# Altium project DC309A.PrjPcb (part 7 of 7)
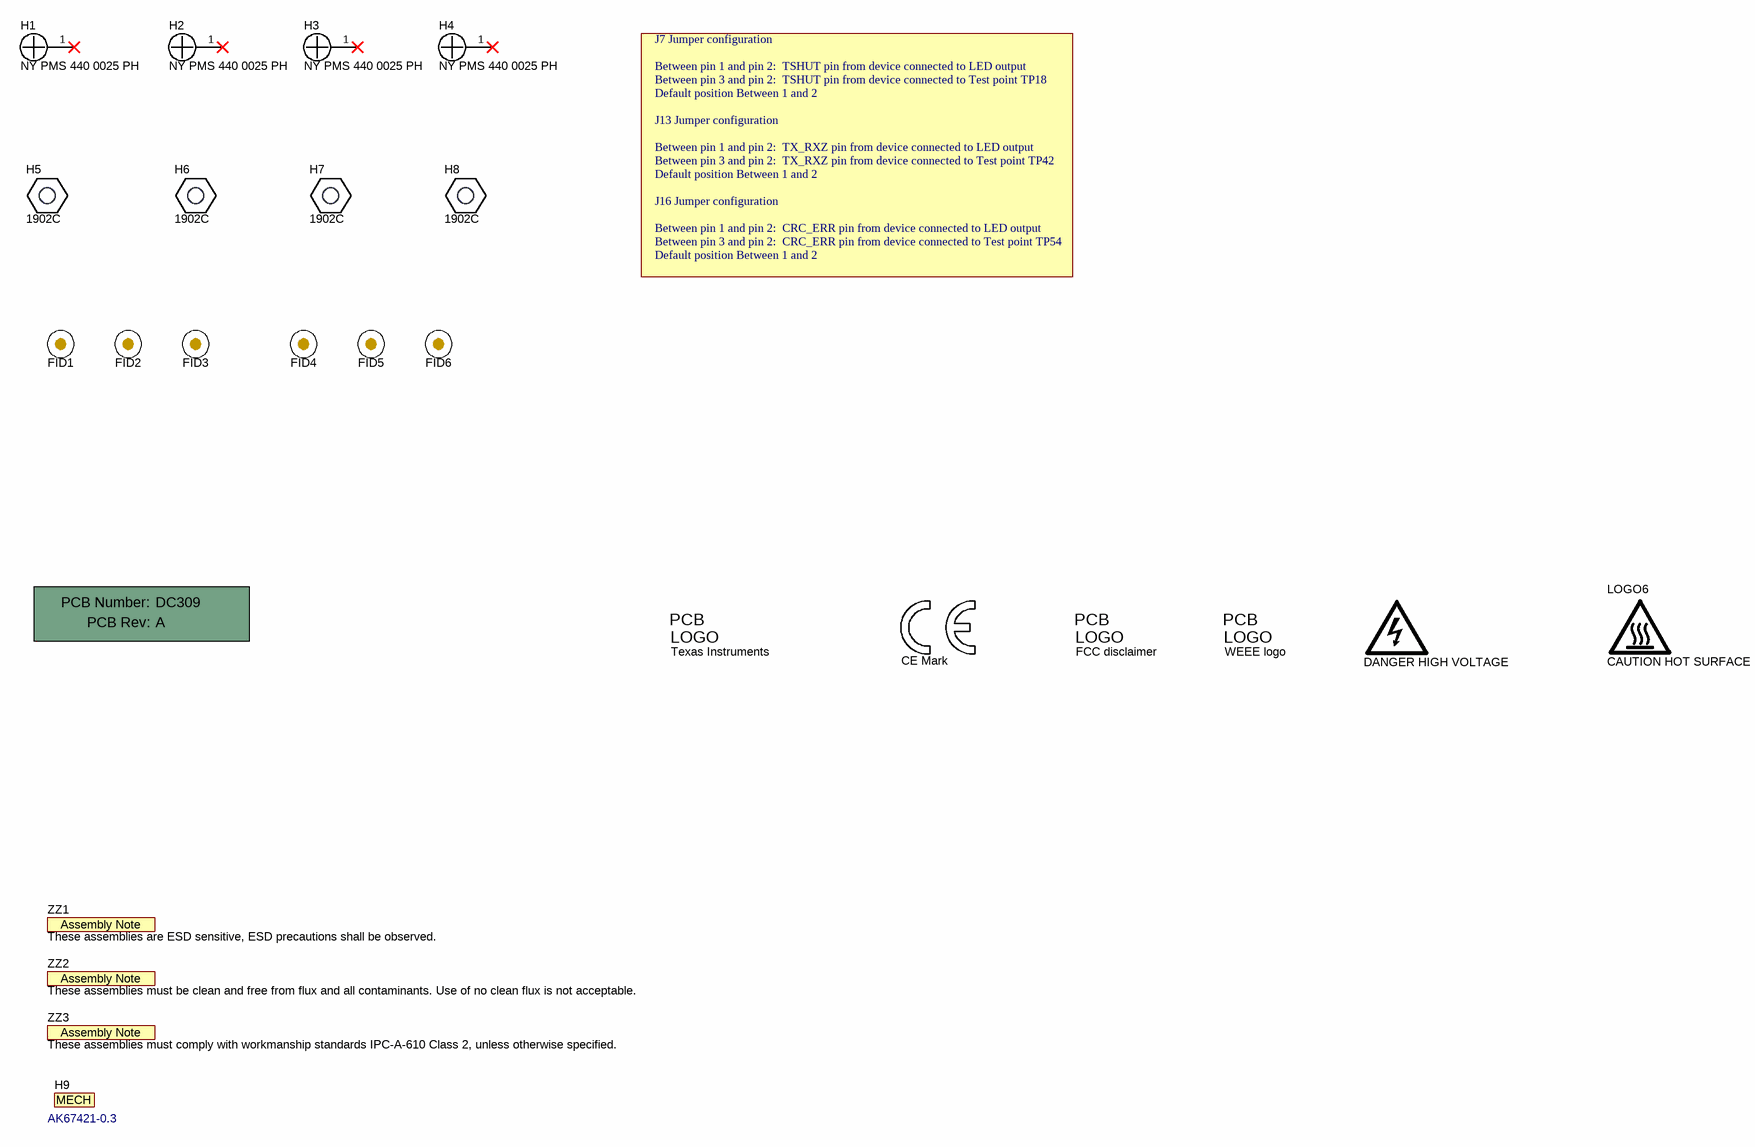
[diagram p31: DC309A_EVM_Hardware.SchDoc]

## Nets that join several sheets
3P3V_FTDI: DC309A_FTDI (43 pins), DC309A_FTDI(DNI) (7 pins)
AVDD_IO: DC309A_Pinout (8 pins), DC309A_PowerSupplies (R17.2)
GND: DC309A_Pinout (52 pins), DC309A_RXIN (164 pins), DC309A_TXOUT (137 pins), DC309A_PowerSupplies (46 pins), DC309A_FTDI (19 pins), DC309A_CLKGen (44 pins), DC309A_External_Sync (26 pins), DC309A_CPLD (53 pins), DC309A_FTDI(DNI) (8 pins)
MHV: DC309A_Pinout (24 pins), DC309A_PowerSupplies (5 pins)
PHV: DC309A_Pinout (16 pins), DC309A_PowerSupplies (5 pins)
USB_GND: DC309A_FTDI (54 pins), DC309A_FTDI(DNI) (8 pins)
V_1P8: DC309A_PowerSupplies (9 pins), DC309A_CPLD (J11.4)
V_2P5: DC309A_PowerSupplies (7 pins), DC309A_FTDI (U6.10 U8.10 U14.10 U17.10), DC309A_FTDI(DNI) (U6_1.10 U8_1.10 U14_1.10 U17_1.10)
V_3P3: DC309A_PowerSupplies (5 pins), DC309A_FTDI (C161.1 R152.2 R154.2 U16.8), DC309A_External_Sync (18 pins)
VDDM_LV5: DC309A_Pinout (6 pins), DC309A_PowerSupplies (5 pins)
VDDP_LV5: DC309A_Pinout (6 pins), DC309A_PowerSupplies (17 pins)
CLK_SYNC_LATCH: DC309A_CLKGen (R244.2), DC309A_External_Sync (U42.1 U42.5)
CLKM_CPLD: DC309A_CLKGen (U12.21), DC309A_CPLD (U11.3)
CLKP_CPLD: DC309A_CLKGen (U12.22), DC309A_CPLD (U11.4)
CRC_ERR_FUNC: DC309A_Pinout (J16.1 R45.1), DC309A_CPLD (U9.38)
EN_CRC: DC309A_Pinout (R420.1 R424.2 U1.B10), DC309A_CPLD (TP26.1 U9.33)
ENSYNC_FTDI: DC309A_FTDI (U6.3 U7.20), DC309A_FTDI(DNI) (U6_1.3)
ENSYNC_TO_CPLD: DC309A_FTDI (U6.14), DC309A_External_Sync (U40.3), DC309A_CPLD (U9.96), DC309A_FTDI(DNI) (U6_1.14)
EXTERNAL_SYNC: DC309A_External_Sync (J12.1 R139.2 R276.2), DC309A_CPLD (U9.84)
OUT1: DC309A_Pinout (U1.A9), DC309A_TXOUT (R352.1)
OUT2: DC309A_Pinout (U1.A8), DC309A_TXOUT (R347.1)
OUT3: DC309A_Pinout (U1.B8), DC309A_TXOUT (R362.1 TP53.1)
OUT4: DC309A_Pinout (U1.B9), DC309A_TXOUT (R387.1 TP55.1)
OUT5: DC309A_Pinout (U1.E7), DC309A_TXOUT (R365.1)
OUT6: DC309A_Pinout (U1.D7), DC309A_TXOUT (R389.1)
OUT7: DC309A_Pinout (U1.E5), DC309A_TXOUT (R369.1)
OUT8: DC309A_Pinout (U1.D6), DC309A_TXOUT (R391.1)
OUT9: DC309A_Pinout (U1.D5), DC309A_TXOUT (R371.1 TP85.1)
OUT10: DC309A_Pinout (U1.C5), DC309A_TXOUT (R393.1 TP86.1)
OUT11: DC309A_Pinout (U1.C8), DC309A_TXOUT (R373.1)
OUT12: DC309A_Pinout (U1.C7), DC309A_TXOUT (R395.1)
OUT13: DC309A_Pinout (U1.B5), DC309A_TXOUT (R397.1)
OUT14: DC309A_Pinout (U1.B6), DC309A_TXOUT (R432.1)
OUT15: DC309A_Pinout (U1.B7), DC309A_TXOUT (R399.1 TP56.1)
OUT16: DC309A_Pinout (U1.C6), DC309A_TXOUT (R434.1 TP60.1)
OUT17: DC309A_Pinout (U1.A3), DC309A_TXOUT (R404.1)
OUT18: DC309A_Pinout (U1.A2), DC309A_TXOUT (R436.1)
OUT19: DC309A_Pinout (U1.A1), DC309A_TXOUT (R406.1 TP57.1)
OUT20: DC309A_Pinout (U1.B2), DC309A_TXOUT (R438.1 TP61.1)
OUT21: DC309A_Pinout (U1.G3), DC309A_TXOUT (R408.1 TP58.1)
OUT22: DC309A_Pinout (U1.G2), DC309A_TXOUT (R440.1 TP62.1)
OUT23: DC309A_Pinout (U1.G1), DC309A_TXOUT (R410.1 TP87.1)
OUT24: DC309A_Pinout (U1.F2), DC309A_TXOUT (R442.1 TP88.1)
OUT25: DC309A_Pinout (U1.B3), DC309A_TXOUT (R444.1 TP89.1)
OUT26: DC309A_Pinout (U1.B4), DC309A_TXOUT (R468.1 TP91.1)
OUT27: DC309A_Pinout (U1.F3), DC309A_TXOUT (R446.1)
OUT28: DC309A_Pinout (U1.E3), DC309A_TXOUT (R470.1)
OUT29: DC309A_Pinout (U1.F1), DC309A_TXOUT (R448.1 TP90.1)
OUT30: DC309A_Pinout (U1.E2), DC309A_TXOUT (R472.1 TP92.1)
OUT31: DC309A_Pinout (U1.E1), DC309A_TXOUT (R450.1)
OUT32: DC309A_Pinout (U1.B1), DC309A_TXOUT (R474.1)
OUT33: DC309A_Pinout (U1.P9), DC309A_TXOUT (R452.1 TP63.1)
OUT34: DC309A_Pinout (U1.P8), DC309A_TXOUT (R476.1 TP64.1)
OUT35: DC309A_Pinout (U1.N8), DC309A_TXOUT (R454.1 TP48.1)
OUT36: DC309A_Pinout (U1.N9), DC309A_TXOUT (R478.1 TP49.1)
OUT37: DC309A_Pinout (U1.K7), DC309A_TXOUT (R480.1)
OUT38: DC309A_Pinout (U1.L7), DC309A_TXOUT (R504.1)
OUT39: DC309A_Pinout (U1.K5), DC309A_TXOUT (R482.1)
OUT40: DC309A_Pinout (U1.L6), DC309A_TXOUT (R506.1)
OUT41: DC309A_Pinout (U1.L5), DC309A_TXOUT (R484.1)
OUT42: DC309A_Pinout (U1.M5), DC309A_TXOUT (R508.1)
OUT43: DC309A_Pinout (U1.M8), DC309A_TXOUT (R486.1 TP93.1)
OUT44: DC309A_Pinout (U1.M7), DC309A_TXOUT (R510.1 TP94.1)
OUT45: DC309A_Pinout (U1.N5), DC309A_TXOUT (R488.1)
OUT46: DC309A_Pinout (U1.N6), DC309A_TXOUT (R512.1)
OUT47: DC309A_Pinout (U1.N7), DC309A_TXOUT (R490.1)
OUT48: DC309A_Pinout (U1.M6), DC309A_TXOUT (R514.1)
OUT49: DC309A_Pinout (U1.P3), DC309A_TXOUT (R516.1 TP95.1)
OUT50: DC309A_Pinout (U1.P2), DC309A_TXOUT (R540.1 TP98.1)
OUT51: DC309A_Pinout (U1.P1), DC309A_TXOUT (R518.1)
OUT52: DC309A_Pinout (U1.N2), DC309A_TXOUT (R542.1)
OUT53: DC309A_Pinout (U1.H3), DC309A_TXOUT (R520.1 TP96.1)
OUT54: DC309A_Pinout (U1.H2), DC309A_TXOUT (R544.1 TP99.1)
OUT55: DC309A_Pinout (U1.H1), DC309A_TXOUT (R522.1 TP65.1)
OUT56: DC309A_Pinout (U1.J2), DC309A_TXOUT (R546.1 TP66.1)
OUT57: DC309A_Pinout (U1.N3), DC309A_TXOUT (R524.1 TP97.1)
OUT58: DC309A_Pinout (U1.N4), DC309A_TXOUT (R548.1 TP100.1)
OUT59: DC309A_Pinout (U1.J3), DC309A_TXOUT (R526.1)
OUT60: DC309A_Pinout (U1.K3), DC309A_TXOUT (R550.1)
OUT61: DC309A_Pinout (U1.J1), DC309A_TXOUT (R552.1)
OUT62: DC309A_Pinout (U1.K2), DC309A_TXOUT (R560.1)
OUT63: DC309A_Pinout (U1.K1), DC309A_TXOUT (R554.1 TP67.1)
OUT64: DC309A_Pinout (U1.N1), DC309A_TXOUT (R562.1 TP68.1)
RESET_0: DC309A_FTDI (TP15.1 U8.14), DC309A_CPLD (R22.1), DC309A_FTDI(DNI) (U8_1.14)
RESET_DIV_FTDI: DC309A_FTDI (U7.49 U14.3), DC309A_FTDI(DNI) (U14_1.3)
RESET_DIV_TO_CPLD: DC309A_FTDI (U14.14), DC309A_CPLD (R138.1 U9.97), DC309A_FTDI(DNI) (U14_1.14)
RESET_FTDI: DC309A_FTDI (U7.15 U8.3), DC309A_FTDI(DNI) (U8_1.3)
RST: DC309A_Pinout (U1.E8), DC309A_CPLD (R125.2 R128.2)
RXP1: DC309A_Pinout (U1.B14), DC309A_RXIN (C179.1 J6.12 R94.2)
RXP2: DC309A_Pinout (U1.A14), DC309A_RXIN (C195.1 J6.10 R239.2)
RXP3: DC309A_Pinout (U1.B13), DC309A_RXIN (C188.1 J6.16 R107.2)
RXP4: DC309A_Pinout (U1.A13), DC309A_RXIN (C204.1 J6.18 R282.2)
RXP5: DC309A_Pinout (U1.A12), DC309A_RXIN (C79.1 J5.10 R55.2)
RXP6: DC309A_Pinout (U1.B12), DC309A_RXIN (C95.1 J5.12 R81.2)
RXP7: DC309A_Pinout (U1.E12), DC309A_RXIN (C189.1 J6.22 R117.2)
RXP8: DC309A_Pinout (U1.F12), DC309A_RXIN (C205.1 J6.24 R287.2)
RXP9: DC309A_Pinout (U1.D12), DC309A_RXIN (C186.1 J6.17 R102.2 TP69.1)
RXP10: DC309A_Pinout (U1.C12), DC309A_RXIN (C202.1 J6.15 R261.2 TP70.1)
RXP11: DC309A_Pinout (U1.A11), DC309A_RXIN (C71.1 J5.4 R46.2)
RXP12: DC309A_Pinout (U1.B11), DC309A_RXIN (C87.1 J5.6 R64.2)
RXP13: DC309A_Pinout (U1.C13), DC309A_RXIN (C181.1 J5.22 R96.2)
RXP14: DC309A_Pinout (U1.D13), DC309A_RXIN (C197.1 J5.24 R256.2)
RXP15: DC309A_Pinout (U1.D14), DC309A_RXIN (C74.1 J5.23 R49.2 TP101.1)
RXP16: DC309A_Pinout (U1.C14), DC309A_RXIN (C90.1 J5.21 R70.2 TP105.1)
RXP17: DC309A_Pinout (U1.F11), DC309A_RXIN (C78.1 J6.21 R54.2 TP71.1)
RXP18: DC309A_Pinout (U1.F10), DC309A_RXIN (C94.1 J6.23 R80.2 TP72.1)
RXP19: DC309A_Pinout (U1.F8), DC309A_RXIN (C72.1 J5.5 R47.2 TP102.1)
RXP20: DC309A_Pinout (U1.F9), DC309A_RXIN (C88.1 J5.3 R68.2 TP106.1)
RXP21: DC309A_Pinout (U1.C11), DC309A_RXIN (C187.1 J5.11 R106.2 TP103.1)
RXP22: DC309A_Pinout (U1.D11), DC309A_RXIN (C203.1 J5.9 R281.2 TP107.1)
RXP23: DC309A_Pinout (U1.D10), DC309A_RXIN (C180.1 J5.15 R95.2 TP104.1)
RXP24: DC309A_Pinout (U1.C10), DC309A_RXIN (C196.1 J5.17 R255.2 TP108.1)
RXP25: DC309A_Pinout (U1.D9), DC309A_RXIN (C80.1 J6.6 R56.2)
RXP26: DC309A_Pinout (U1.E9), DC309A_RXIN (C96.1 J6.4 R82.2)
RXP27: DC309A_Pinout (U1.G11), DC309A_RXIN (C178.1 J5.18 R93.2)
RXP28: DC309A_Pinout (U1.G12), DC309A_RXIN (C194.1 J5.16 R238.2)
RXP29: DC309A_Pinout (U1.G8), DC309A_RXIN (C81.1 J6.11 R57.2 TP73.1)
RXP30: DC309A_Pinout (U1.G9), DC309A_RXIN (C97.1 J6.9 R83.2 TP75.1)
RXP31: DC309A_Pinout (U1.G6), DC309A_RXIN (C84.1 J6.5 R60.2 TP74.1)
RXP32: DC309A_Pinout (U1.G7), DC309A_RXIN (C175.1 J6.3 R87.2 TP76.1)
RXP33: DC309A_Pinout (U1.N14), DC309A_RXIN (C191.1 J5.34 R159.2)
RXP34: DC309A_Pinout (U1.P14), DC309A_RXIN (C213.1 J5.36 R289.2)
RXP35: DC309A_Pinout (U1.N13), DC309A_RXIN (C86.1 J6.34 R63.2)
RXP36: DC309A_Pinout (U1.P13), DC309A_RXIN (C177.1 J6.36 R90.2)
RXP37: DC309A_Pinout (U1.P12), DC309A_RXIN (C82.1 J5.45 R58.2 TP109.1)
RXP38: DC309A_Pinout (U1.N12), DC309A_RXIN (C98.1 J5.47 R84.2 TP112.1)
RXP39: DC309A_Pinout (U1.K12), DC309A_RXIN (C190.1 J5.29 R121.2 TP110.1)
RXP40: DC309A_Pinout (U1.J12), DC309A_RXIN (C207.1 J5.27 R288.2 TP113.1)
RXP41: DC309A_Pinout (U1.L12), DC309A_RXIN (C193.1 J5.39 R237.2 TP111.1)
RXP42: DC309A_Pinout (U1.M12), DC309A_RXIN (C215.1 J5.41 R291.2 TP114.1)
RXP43: DC309A_Pinout (U1.P11), DC309A_RXIN (C76.1 J6.45 R51.2 TP77.1)
RXP44: DC309A_Pinout (U1.N11), DC309A_RXIN (C92.1 J6.47 R75.2 TP81.1)
RXP45: DC309A_Pinout (U1.M13), DC309A_RXIN (C75.1 J6.29 R50.2 TP78.1)
RXP46: DC309A_Pinout (U1.L13), DC309A_RXIN (C91.1 J6.27 R71.2 TP82.1)
RXP47: DC309A_Pinout (U1.L14), DC309A_RXIN (C182.1 J6.28 R97.2)
RXP48: DC309A_Pinout (U1.M14), DC309A_RXIN (C198.1 J6.30 R257.2)
RXP49: DC309A_Pinout (U1.J11), DC309A_RXIN (C83.1 J5.30 R59.2)
RXP50: DC309A_Pinout (U1.J10), DC309A_RXIN (C174.1 J5.28 R85.2)
RXP51: DC309A_Pinout (U1.J8), DC309A_RXIN (C184.1 J5.40 R99.2)
RXP52: DC309A_Pinout (U1.J9), DC309A_RXIN (C200.1 J5.42 R259.2)
RXP53: DC309A_Pinout (U1.M11), DC309A_RXIN (C2.1 J6.39 R328.2 TP79.1)
RXP54: DC309A_Pinout (U1.L11), DC309A_RXIN (C5.1 J6.41 R343.2 TP83.1)
RXP55: DC309A_Pinout (U1.L10), DC309A_RXIN (C183.1 J6.35 R98.2 TP80.1)
RXP56: DC309A_Pinout (U1.M10), DC309A_RXIN (C199.1 J6.33 R258.2 TP84.1)
RXP57: DC309A_Pinout (U1.L9), DC309A_RXIN (C6.1 J5.46 R349.2)
RXP58: DC309A_Pinout (U1.K9), DC309A_RXIN (C22.1 J5.48 R359.2)
RXP59: DC309A_Pinout (U1.H11), DC309A_RXIN (C185.1 J5.33 R101.2 TP115.1)
RXP60: DC309A_Pinout (U1.H12), DC309A_RXIN (C201.1 J5.35 R260.2 TP116.1)
RXP61: DC309A_Pinout (U1.H8), DC309A_RXIN (C77.1 J6.46 R53.2)
RXP62: DC309A_Pinout (U1.H9), DC309A_RXIN (C93.1 J6.48 R76.2)
RXP63: DC309A_Pinout (U1.H6), DC309A_RXIN (C73.1 J6.40 R48.2)
RXP64: DC309A_Pinout (U1.H7), DC309A_RXIN (C89.1 J6.42 R69.2)
SCL_TO_INA: DC309A_FTDI (R154.1 U16.6), DC309A_CLKGen (U13.8)
SCLK_DIRECT: DC309A_FTDI (U44.12), DC309A_CPLD (R127.2)
SCLK_FTDI: DC309A_FTDI (U7.13 U8.5), DC309A_FTDI(DNI) (U8_1.5)
SCLK_TO_CPLD: DC309A_FTDI (TP17.1 U8.12 U44.1), DC309A_CPLD (U9.85), DC309A_FTDI(DNI) (U8_1.12)
SCLKM: DC309A_Pinout (U1.H14), DC309A_CPLD (R91.1 R100.2 R165.1 R234.1)
SCLKP: DC309A_Pinout (U1.H13), DC309A_CPLD (R78.1 R86.2 R91.2 R127.1)
SDA_TO_INA: DC309A_FTDI (R152.1 U16.7), DC309A_CLKGen (U13.7)
SDATA0_DIRECT: DC309A_FTDI (U44.11), DC309A_CPLD (R254.2)
SDATA0_FTDI: DC309A_FTDI (U7.14 U8.4), DC309A_FTDI(DNI) (U8_1.4)
SDATA0_TO_CPLD: DC309A_FTDI (TP16.1 U8.13 U44.2), DC309A_CPLD (U9.89), DC309A_FTDI(DNI) (U8_1.13)
SDATA1_FTDI: DC309A_FTDI (U7.19 U8.6), DC309A_FTDI(DNI) (U8_1.6)
SDATA1_TO_CPLD: DC309A_FTDI (TP30.1 U8.11), DC309A_CPLD (U9.91), DC309A_FTDI(DNI) (U8_1.11)
SDINM0: DC309A_Pinout (U1.E14), DC309A_CPLD (R109.1 R116.2 R169.1 R235.1)
SDINM1: DC309A_Pinout (U1.F14), DC309A_CPLD (R38.1 R41.2 R111.1 R163.1)
SDINP0: DC309A_Pinout (U1.E13), DC309A_CPLD (R103.1 R105.2 R109.2 R254.1)
SDINP1: DC309A_Pinout (U1.F13), DC309A_CPLD (R16.2 R32.1 R34.2 R38.2)
SDOUT: DC309A_Pinout (U1.P10), DC309A_FTDI (U44.9), DC309A_CPLD (TP37.1 U9.49)
SDOUT_FROM_CPLD: DC309A_FTDI (U6.11 U44.4), DC309A_CPLD (U9.92), DC309A_FTDI(DNI) (U6_1.11)
SDOUT_FTDI: DC309A_FTDI (U6.6 U7.12), DC309A_FTDI(DNI) (U6_1.6)
SEN_CPLD_FTDI: DC309A_FTDI (U6.4 U7.18), DC309A_FTDI(DNI) (U6_1.4)
SEN_CPLD_TO_CPLD: DC309A_FTDI (U6.13), DC309A_CPLD (U9.87), DC309A_FTDI(DNI) (U6_1.13)
SEN_DIRECT: DC309A_FTDI (U44.10), DC309A_CPLD (R126.2)
SEN_FTDI: DC309A_FTDI (U6.5 U7.17), DC309A_FTDI(DNI) (U6_1.5)
SEN_TX7364_TO_CPLD: DC309A_FTDI (TP14.1 U6.12 U44.3), DC309A_CPLD (U9.86), DC309A_FTDI(DNI) (U6_1.12)
SENM: DC309A_Pinout (U1.G14), DC309A_CPLD (R67.1 R77.2 R233.1)
SENP: DC309A_Pinout (U1.G13), DC309A_CPLD (R42.1 R65.2 R67.2 R126.1)
SP2_FTDI: DC309A_FTDI (U7.51 U14.4), DC309A_FTDI(DNI) (U14_1.4)
SP2_TO_CPLD: DC309A_FTDI (U14.13), DC309A_CPLD (U9.98), DC309A_FTDI(DNI) (U14_1.13)
SP3_FTDI: DC309A_FTDI (U7.52 U14.5), DC309A_FTDI(DNI) (U14_1.5)
SP3_TO_CPLD: DC309A_FTDI (U14.12), DC309A_CPLD (U9.99), DC309A_FTDI(DNI) (U14_1.12)
SP4_FROM_CPLD: DC309A_FTDI (U14.11), DC309A_CPLD (U9.100), DC309A_FTDI(DNI) (U14_1.11)
SP4_FTDI: DC309A_FTDI (U7.53 U14.6), DC309A_FTDI(DNI) (U14_1.6)
SPI_MODE: DC309A_Pinout (R421.1 R425.2 U1.A10), DC309A_CPLD (TP24.1 U9.27)
STDBY: DC309A_Pinout (R422.1 R426.2 U1.L8), DC309A_CPLD (TP22.1 U9.28)
SYNCHRONIZER: DC309A_External_Sync (U18.4), DC309A_CPLD (TP23.1 U9.1)
SYNCM: DC309A_Pinout (U1.K14), DC309A_CPLD (R21.1 R23.1 R31.2 R274.1)
SYNCM_LVDS_EXT: DC309A_External_Sync (R265.1), DC309A_CPLD (R274.2)
SYNCP: DC309A_Pinout (U1.K13), DC309A_CPLD (R19.2 R21.2 R23.2 R273.1)
SYNCP_LVDS_EXT: DC309A_External_Sync (R263.1), DC309A_CPLD (R273.2)
TCK_FTDI: DC309A_FTDI (U7.42 U17.3), DC309A_FTDI(DNI) (U17_1.3)
TCK_TO_CPLD: DC309A_FTDI (TP6.1 U17.14), DC309A_CPLD (R24.1), DC309A_FTDI(DNI) (U17_1.14)
TDI_FTDI: DC309A_FTDI (U7.46 U17.4), DC309A_FTDI(DNI) (U17_1.4)
TDI_TO_CPLD: DC309A_FTDI (TP7.1 U17.13), DC309A_CPLD (R132.1), DC309A_FTDI(DNI) (U17_1.13)
TDO_FROM_CPLD: DC309A_FTDI (TP9.1 U17.11), DC309A_CPLD (R28.1), DC309A_FTDI(DNI) (U17_1.11)
TDO_FTDI: DC309A_FTDI (U7.47 U17.6), DC309A_FTDI(DNI) (U17_1.6)
TMS_FTDI: DC309A_FTDI (U7.48 U17.5), DC309A_FTDI(DNI) (U17_1.5)
TMS_TO_CPLD: DC309A_FTDI (TP8.1 U17.12), DC309A_CPLD (R40.1), DC309A_FTDI(DNI) (U17_1.12)
TSHUT_FUNC: DC309A_Pinout (J7.1 R43.1), DC309A_CPLD (U9.34)
TX_CLKM: DC309A_Pinout (C27.2), DC309A_CLKGen (R123.2 R243.2 R252.2)
TX_CLKP: DC309A_Pinout (C26.2), DC309A_CLKGen (R122.2 R242.2 R253.2)
TX_RXZ_FUNC: DC309A_Pinout (J13.1 R44.1), DC309A_CPLD (U9.30)
V_1P8_CPLD: DC309A_PowerSupplies (R170.2), DC309A_FTDI (C212.2 U44.13), DC309A_CPLD (14 pins)
V_2P5_CPLD: DC309A_PowerSupplies (R168.2), DC309A_FTDI (13 pins), DC309A_External_Sync (C285.2 U40.1 U40.5), DC309A_CPLD (19 pins), DC309A_FTDI(DNI) (U6_1.16 U8_1.16 U14_1.16 U17_1.16)
V_3P3_LMK: DC309A_PowerSupplies (R167.2), DC309A_CLKGen (30 pins)
WAKE_UP: DC309A_Pinout (R419.1 R423.2 U1.M9), DC309A_CPLD (TP27.1 U9.35)

## Assembly variants
001: not fitted C101 C102 C162 C163 C164 C165 C167 C168 C170 C171 C172 C211 C212 C277 C278 C279 C280 R20 R23 R24 R28 R29 R32 R36 R38 R40 R42 R52 R67 R78 R91 R103 R109 R125 R126 R127 R132 R149 R150 R160 R164 R166 R172 R174 R176 R178 R179 R214 R216 R240 R241 R242 R243 R244 R245 R246 R247 R249 R250 R251 R252 R253 R254 R262 R268 R269 R270 R271 R273 R274 R280 R283 R284 R307 R308 R309 R310 R311 R312 R313 R329 R330 R331 R332 R333 R334 R335 R350 R351 R353 R354 R375 R376 R377 R378 R379 R380 R381 R382 R383 R384 R385 R404 R405 R406 R407 R408 R409 R410 R411 R412 R413 R414 R415 R416 R417 R418 R420 R421 R422 R423 R424 R425 R426 R427 R428 R429 R430 R431 R456 R457 R458 R459 R460 R461 R462 R463 R464 R465 R466 R467 R492 R493 R494 R495 R496 R497 R498 R499 R500 R501 R502 R503 R528 R529 R530 R531 R532 R533 R534 R535 R536 R537 R538 R539 R556 R557 R558 R559 TP59 U6_1 U8_1 U14_1 U17_1 U33 U34 U41 U42 U44
Compact: not fitted C34 C63 C64 C65 C101 C102 C108 C109 C110 C111 C112 C113 C114 C115 C116 C117 C118 C119 C121 C122 C123 C124 C125 C130 C131 C133 C134 C135 C137 C139 C160 C162 C163 C164 C165 J11 J15 R19 R20 R21 R23 R24 R27 R28 R29 R31 R32 R33 R34 R35 R37 R38 R39 R40 R41 R52 R62 R65 R66 R67 R74 R77 R79 R86 R89 R91 R92 R100 R104 R105 R108 R109 R111 R112 R113 R114 R115 R116 R120 R122 R123 R128 R131 R132 R133 R138 R140 R142 R144 R146 R147 R148 R151 R153 R160 R164 R166 R172 R173 R176 R178 R179 R214 R216 R234 R235 R236 R240 R241 R247 R248 R262 R268 R269 R270 R271 R276 R283 R286 R307 R308 R309 R310 R311 R312 R313 R329 R330 R331 R332 R333 R334 R335 R350 R351 R353 R354 R375 R376 R377 R378 R379 R380 R381 R382 R383 R384 R385 R412 R413 R414 R415 R416 R417 R418 R420 R422 R423 R425 R427 R428 R429 R430 R431 R456 R457 R458 R459 R460 R461 R462 R463 R464 R465 R466 R467 R492 R493 R494 R495 R496 R497 R498 R499 R500 R501 R502 R503 R528 R529 R530 R531 R532 R533 R534 R535 R536 R537 R538 R539 R556 R557 R558 R559 S2 S3 TP19 TP21 U2 U5 U6_1 U8_1 U9 U11 U12 U13 U14 U14_1 U16 U17 U17_1 U51